# EAGLE schematic fanbus (EAGLE 6.6.0)

## Sheet 1 of 2: Control
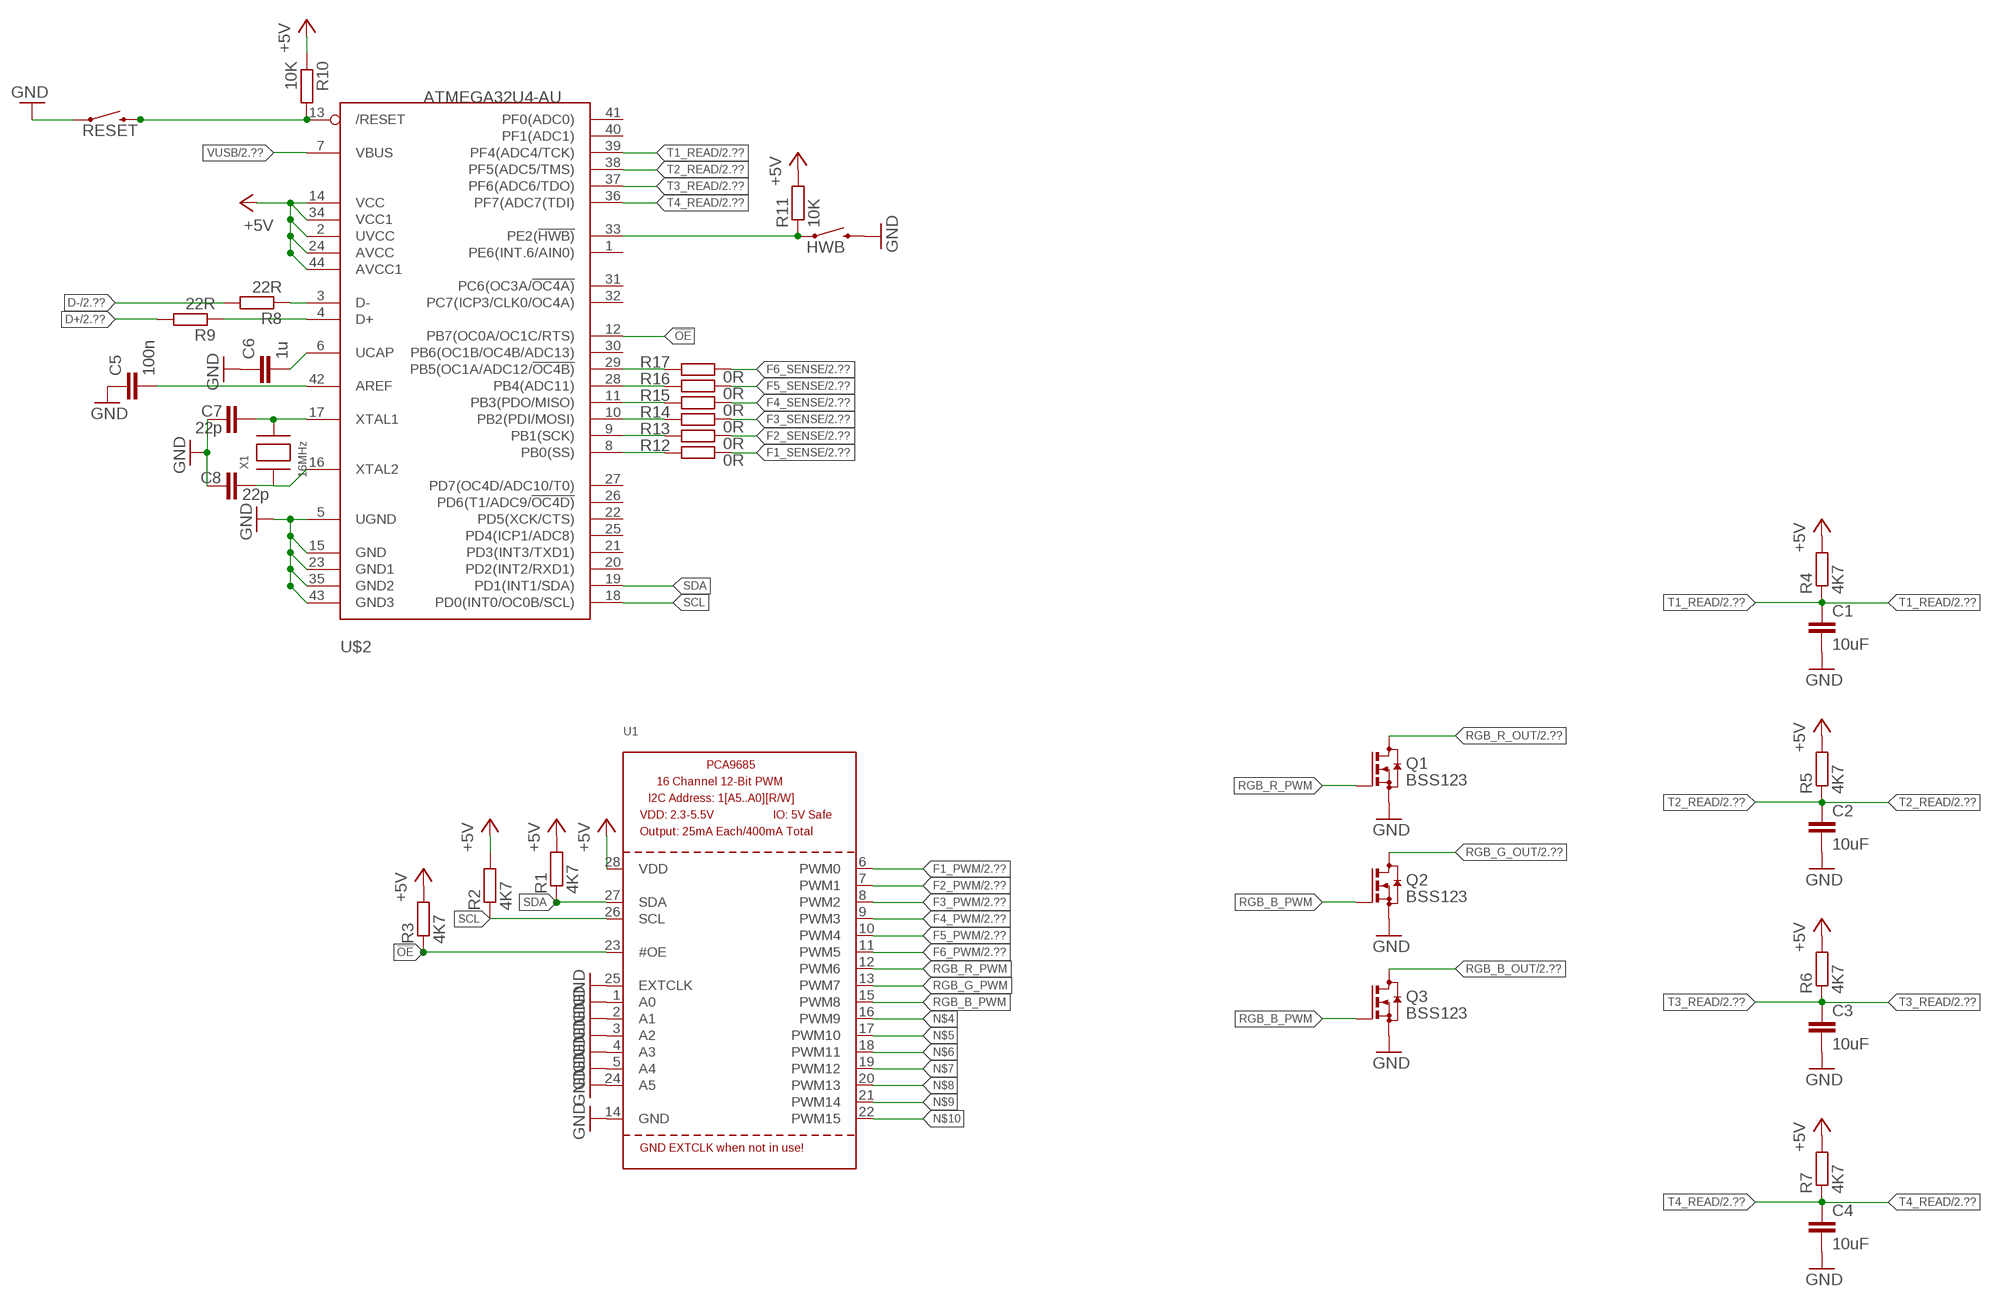
[diagram p0: schematic, sheet 1]

### Parts
C1  10uF  C-EUC0805K  [C0805K]
C2  10uF  C-EUC0805K  [C0805K]
C3  10uF  C-EUC0805K  [C0805K]
C4  10uF  C-EUC0805K  [C0805K]
C5  100n  C-EUC0805K  [C0805K]
C6  1u  C-EUC0805K  [C0805K]
C7  22p  C-EUC0805K  [C0805K]
C8  22p  C-EUC0805K  [C0805K]
HWB  SWITCH-MOMENTARY-2SMD  [TACTILE_SWITCH_SMD]
Q1  BSS123  [SOT23]
Q2  BSS123  [SOT23]
Q3  BSS123  [SOT23]
R1  4K7  R-EU_R0805  [R0805]
R2  4K7  R-EU_R0805  [R0805]
R3  4K7  R-EU_R0805  [R0805]
R4  4K7  R-EU_R0805  [R0805]
R5  4K7  R-EU_R0805  [R0805]
R6  4K7  R-EU_R0805  [R0805]
R7  4K7  R-EU_R0805  [R0805]
R8  22R  R-EU_R0805  [R0805]
R9  22R  R-EU_R0805  [R0805]
R10  10K  R-EU_R0805  [R0805]
R11  10K  R-EU_R0805  [R0805]
R12  0R  R-EU_R0805  [R0805]
R13  0R  R-EU_R0805  [R0805]
R14  0R  R-EU_R0805  [R0805]
R15  0R  R-EU_R0805  [R0805]
R16  0R  R-EU_R0805  [R0805]
R17  0R  R-EU_R0805  [R0805]
RESET  SWITCH-MOMENTARY-2SMD  [TACTILE_SWITCH_SMD]
U1  PCA9685  [TSSOP28]
U$2  ATMEGA32U4-AU  [TQFP44]
X1  16MHz  XTAL-3.2X1.5  [XTAL3215]

### Nets
!OE: R3.1 U1.23(#OE) U$2.12(PB7(OC0A/OC1C/RTS))
+5V: R1.2 R2.2 R3.2 R4.2 R5.2 R6.2 R7.2 R10.1 R11.2 U1.28(VDD) U$2.2(UVCC) U$2.14(VCC) U$2.24(AVCC) U$2.34(VCC1) U$2.44(AVCC1) ; also sheet 2
D+: R9.2 ; also sheet 2
D-: R8.2 ; also sheet 2
F1_PWM: U1.6(PWM0) ; also sheet 2
F1_SENSE: R12.2 ; also sheet 2
F2_PWM: U1.7(PWM1) ; also sheet 2
F2_SENSE: R13.2 ; also sheet 2
F3_PWM: U1.8(PWM2) ; also sheet 2
F3_SENSE: R14.2 ; also sheet 2
F4_PWM: U1.9(PWM3) ; also sheet 2
F4_SENSE: R15.2 ; also sheet 2
F5_PWM: U1.10(PWM4) ; also sheet 2
F5_SENSE: R16.2 ; also sheet 2
F6_PWM: U1.11(PWM5) ; also sheet 2
F6_SENSE: R17.2 ; also sheet 2
GND: C1.2 C2.2 C3.2 C4.2 C5.1 C6.1 C7.1 C8.1 HWB.3 Q1.2(S) Q2.2(S) Q3.2(S) RESET.1 U1.1(A0) U1.2(A1) U1.3(A2) U1.4(A3) U1.5(A4) U1.14(GND) U1.24(A5) U1.25(EXTCLK) U$2.5(UGND) U$2.15(GND) U$2.23(GND1) U$2.35(GND2) U$2.43(GND3) ; also sheet 2
N$3: R8.1 U$2.3(D-)
N$4: U1.16(PWM9)
N$5: U1.17(PWM10)
N$6: U1.18(PWM11)
N$7: U1.19(PWM12)
N$8: U1.20(PWM13)
N$9: U1.21(PWM14)
N$10: U1.22(PWM15)
N$11: R9.1 U$2.4(D+)
N$12: C5.2 U$2.42(AREF)
N$13: C6.2 U$2.6(UCAP)
N$14: C7.2 U$2.17(XTAL1) X1.P$2
N$15: C8.2 U$2.16(XTAL2) X1.P$1
N$16: R10.2 RESET.3 U$2.13(/RESET)
N$17: HWB.1 R11.1 U$2.33(PE2(!HWB))
N$18: R12.1 U$2.8(PB0(SS))
N$19: R13.1 U$2.9(PB1(SCK))
N$20: R14.1 U$2.10(PB2(PDI/MOSI))
N$21: R15.1 U$2.11(PB3(PDO/MISO))
N$22: R16.1 U$2.28(PB4(ADC11))
N$23: R17.1 U$2.29(PB5(OC1A/ADC12/!OC4B))
RGB_B_OUT: Q3.3(D) ; also sheet 2
RGB_B_PWM: Q2.1(G) Q3.1(G) U1.15(PWM8)
RGB_G_OUT: Q2.3(D) ; also sheet 2
RGB_G_PWM: U1.13(PWM7)
RGB_R_OUT: Q1.3(D) ; also sheet 2
RGB_R_PWM: Q1.1(G) U1.12(PWM6)
SCL: R2.1 U1.26(SCL) U$2.18(PD0(INT0/OC0B/SCL))
SDA: R1.1 U1.27(SDA) U$2.19(PD1(INT1/SDA))
T1_READ: C1.1 R4.1 U$2.39(PF4(ADC4/TCK)) ; also sheet 2
T2_READ: C2.1 R5.1 U$2.38(PF5(ADC5/TMS)) ; also sheet 2
T3_READ: C3.1 R6.1 U$2.37(PF6(ADC6/TDO)) ; also sheet 2
T4_READ: C4.1 R7.1 U$2.36(PF7(ADC7(TDI)) ; also sheet 2
VUSB: U$2.7(VBUS) ; also sheet 2
Unconnected: U$2.1(PE6(INT.6/AIN0)) U$2.20(PD2(INT2/RXD1)) U$2.21(PD3(INT3/TXD1)) U$2.22(PD5(XCK/CTS)) U$2.25(PD4(ICP1/ADC8)) U$2.26(PD6(T1/ADC9/!OC4D)) U$2.27(PD7(OC4D/ADC10/T0)) U$2.30(PB6(OC1B/OC4B/ADC13)) U$2.31(PC6(OC3A/!OC4A)) U$2.32(PC7(ICP3/CLK0/OC4A)) U$2.40(PF1(ADC1)) U$2.41(PF0(ADC0))

## Sheet 2 of 2: Connectors
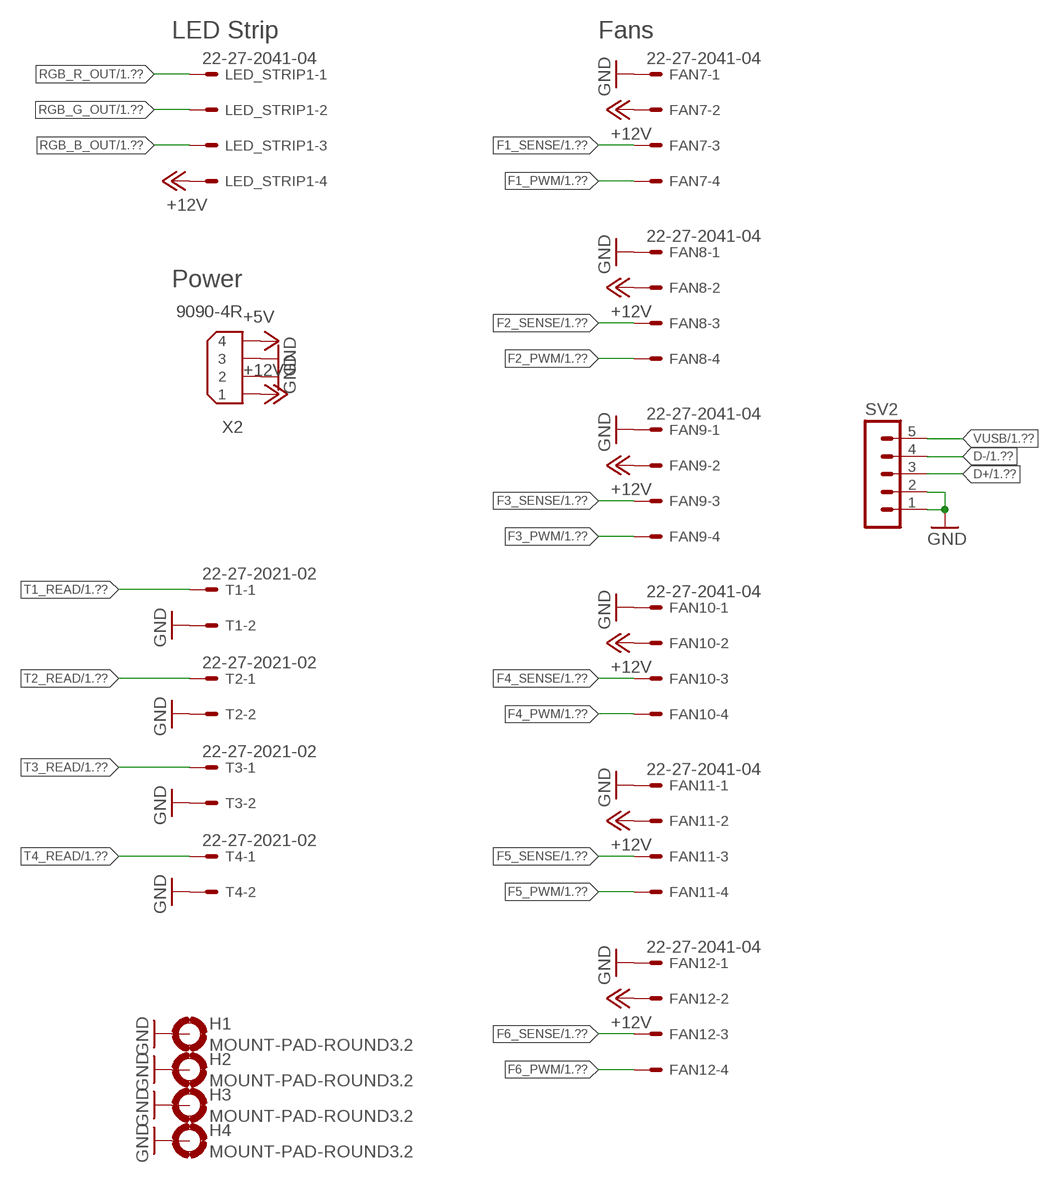
[diagram p1: schematic, sheet 2]

### Parts
FAN7  22-27-2041-04  [6410-04]
FAN8  22-27-2041-04  [6410-04]
FAN9  22-27-2041-04  [6410-04]
FAN10  22-27-2041-04  [6410-04]
FAN11  22-27-2041-04  [6410-04]
FAN12  22-27-2041-04  [6410-04]
H1  MOUNT-PAD-ROUND3.2  [3,2-PAD]
H2  MOUNT-PAD-ROUND3.2  [3,2-PAD]
H3  MOUNT-PAD-ROUND3.2  [3,2-PAD]
H4  MOUNT-PAD-ROUND3.2  [3,2-PAD]
LED_STRIP1  22-27-2041-04  [6410-04]
SV2  MA05-1  [MA05-1]
T1  22-27-2021-02  [6410-02]
T2  22-27-2021-02  [6410-02]
T3  22-27-2021-02  [6410-02]
T4  22-27-2021-02  [6410-02]
X2  9090-4R  [9090-4R]

### Nets
+5V: X2.4 ; also sheet 1
+12V: FAN7.2 FAN8.2 FAN9.2 FAN10.2 FAN11.2 FAN12.2 LED_STRIP1.4 X2.1
D+: SV2.3 ; also sheet 1
D-: SV2.4 ; also sheet 1
F1_PWM: FAN7.4 ; also sheet 1
F1_SENSE: FAN7.3 ; also sheet 1
F2_PWM: FAN8.4 ; also sheet 1
F2_SENSE: FAN8.3 ; also sheet 1
F3_PWM: FAN9.4 ; also sheet 1
F3_SENSE: FAN9.3 ; also sheet 1
F4_PWM: FAN10.4 ; also sheet 1
F4_SENSE: FAN10.3 ; also sheet 1
F5_PWM: FAN11.4 ; also sheet 1
F5_SENSE: FAN11.3 ; also sheet 1
F6_PWM: FAN12.4 ; also sheet 1
F6_SENSE: FAN12.3 ; also sheet 1
GND: FAN7.1 FAN8.1 FAN9.1 FAN10.1 FAN11.1 FAN12.1 H1.B3,2(MOUNT) H2.B3,2(MOUNT) H3.B3,2(MOUNT) H4.B3,2(MOUNT) SV2.1 SV2.2 T1.2 T2.2 T3.2 T4.2 X2.2 X2.3 ; also sheet 1
RGB_B_OUT: LED_STRIP1.3 ; also sheet 1
RGB_G_OUT: LED_STRIP1.2 ; also sheet 1
RGB_R_OUT: LED_STRIP1.1 ; also sheet 1
T1_READ: T1.1 ; also sheet 1
T2_READ: T2.1 ; also sheet 1
T3_READ: T3.1 ; also sheet 1
T4_READ: T4.1 ; also sheet 1
VUSB: SV2.5 ; also sheet 1

### Notes on the sheet
- LED Strip | Fans
- Power

## Library data of the parts
C1-C8 = rcl:C-EU: CAPACITOR, European symbol
FAN7-FAN12 LED_STRIP1 = con-molex:22-?-04: CONNECTOR wire to board 2.54 mm (.1 inch) pitch header; OC_FARNELL: unknown; OC_NEWARK: unknown
H1-H4 = holes:MOUNT-PAD-ROUND: MOUNTING PAD, round
HWB RESET = SparkFun:SWITCH-MOMENTARY-2
Q1-Q3 = transistor-small-signal:BSS123: N-CHANNEL MOS FET
R1-R3 = resistor:R-EU_: RESISTOR, European symbol
R4-R17 = rcl:R-EU_: RESISTOR, European symbol
SV2 = con-lstb:MA05-1: PIN HEADER; OC_FARNELL: unknown; OC_NEWARK: unknown
T1-T4 = con-molex:22-?-02: CONNECTOR wire to board 2.54 mm (.1 inch) pitch header; OC_FARNELL: unknown; OC_NEWARK: unknown
U1 = adafruit:PCA9685: PCA9685 - 16 Channel 12-Bit I2C PWM Controller 5.0V tolerant 16 channel, 12-bit I2C PWM controller with 25mA per output (max. 400mA total) Digikey: 568-5931-1-ND
U$2 = adafruit:ATMEGA32U4: http://www.ladyada.net/library/eagle
X1 = adafruit:XTAL: Low cost SMT crystals, no capacitors included http://www.ladyada.net/library/eagle
X2 = con-thomas-betts:9090-4: Disk Drive Power four position Source: Thomas & Betts Electronic Interconnects Eiropean Edition 1998; OC_FARNELL: unknown; OC_NEWARK: unknown